# Altium schematic sheet PICZoneNew.SchDoc
size A4; Organization: Autobot Limited; Address1: 96, boulevard Bessiere; Address4: 75017 PARIS
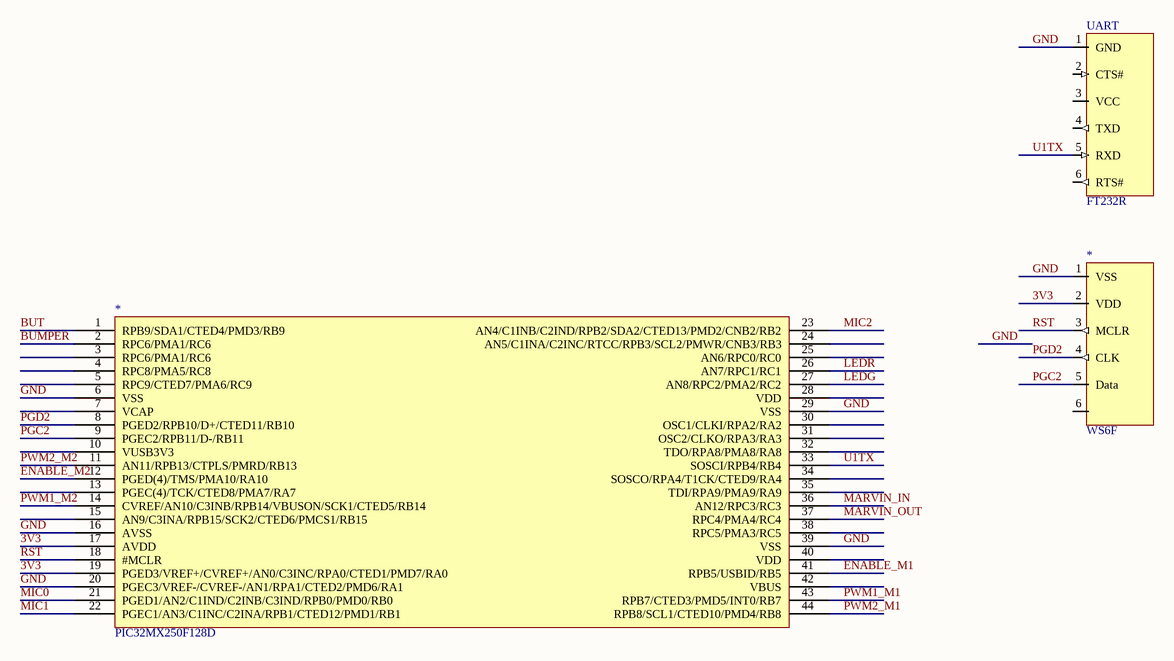
[diagram p0: PICZoneNew.SchDoc]

## Parts
(Parts that share a designator on the sheet are numbered #1, #2 ... from top to bottom, then left to right.)
*#1  WS6F
*#2  PIC32MX250F128D
UART  FT232R

## Nets
3V3: *#1.2(VDD) *#2.17(AVDD) *#2.19(PGED3/VREF+/CVREF+/AN0/C3INC/RPA0/CTED1/PMD7/RA0)
BUMPER: *#2.2(RPC6/PMA1/RC6)
BUT: *#2.1(RPB9/SDA1/CTED4/PMD3/RB9)
ENABLE_M1: *#2.41(RPB5/USBID/RB5)
ENABLE_M2: *#2.12(PGED(4)/TMS/PMA10/RA10)
GND: *#1.1(VSS) *#2.6(VSS) *#2.16(AVSS) *#2.20(PGEC3/VREF-/CVREF-/AN1/RPA1/CTED2/PMD6/RA1) *#2.29(VSS) *#2.39(VSS) UART.1(GND)
LEDG: *#2.27(AN8/RPC2/PMA2/RC2)
LEDR: *#2.26(AN7/RPC1/RC1)
MARVIN_IN: *#2.36(AN12/RPC3/RC3)
MARVIN_OUT: *#2.37(RPC4/PMA4/RC4)
MIC0: *#2.21(PGED1/AN2/C1IND/C2INB/C3IND/RPB0/PMD0/RB0)
MIC1: *#2.22(PGEC1/AN3/C1INC/C2INA/RPB1/CTED12/PMD1/RB1)
MIC2: *#2.23(AN4/C1INB/C2IND/RPB2/SDA2/CTED13/PMD2/CNB2/RB2)
PGC2: *#1.5(Data) *#2.9(PGEC2/RPB11/D-/RB11)
PGD2: *#1.4(CLK) *#2.8(PGED2/RPB10/D+/CTED11/RB10)
PWM1_M1: *#2.43(RPB7/CTED3/PMD5/INT0/RB7)
PWM1_M2: *#2.14(CVREF/AN10/C3INB/RPB14/VBUSON/SCK1/CTED5/RB14)
PWM2_M1: *#2.44(RPB8/SCL1/CTED10/PMD4/RB8)
PWM2_M2: *#2.11(AN11/RPB13/CTPLS/PMRD/RB13)
RST: *#1.3(MCLR) *#2.18(#MCLR)
U1TX: *#2.33(SOSCI/RPB4/RB4) UART.5(RXD)

Not connected (* = marked no-connect by the designer): *#1 6; *#2 3(RPC6/PMA1/RC6) 4(RPC8/PMA5/RC8) 5(RPC9/CTED7/PMA6/RC9) 7(VCAP) 10(VUSB3V3) 13(PGEC(4)/TCK/CTED8/PMA7/RA7) 15(AN9/C3INA/RPB15/SCK2/CTED6/PMCS1/RB15) 24(AN5/C1INA/C2INC/RTCC/RPB3/SCL2/PMWR/CNB3/RB3) 25(AN6/RPC0/RC0) 28(VDD) 30(OSC1/CLKI/RPA2/RA2) 31(OSC2/CLKO/RPA3/RA3) 32(TDO/RPA8/PMA8/RA8) 34(SOSCO/RPA4/T1CK/CTED9/RA4) 35(TDI/RPA9/PMA9/RA9) 38(RPC5/PMA3/RC5) 40(VDD) 42(VBUS); UART 2(CTS#) 3(VCC) 4(TXD) 6(RTS#)

## Notes on the sheet
- Title
- Size:
- Date:
- A4
- Number:
- Time:
- Revision:
- Sheet
- of
- File:

## Library data of the parts
UART = FT232R: Fabricant: MOLEX; Fournisseur: Farnell; RefFournisseur: 9731164; RefFabricant: 22-27-2041